# EAGLE design Nowboard (EAGLE 9.3.0)
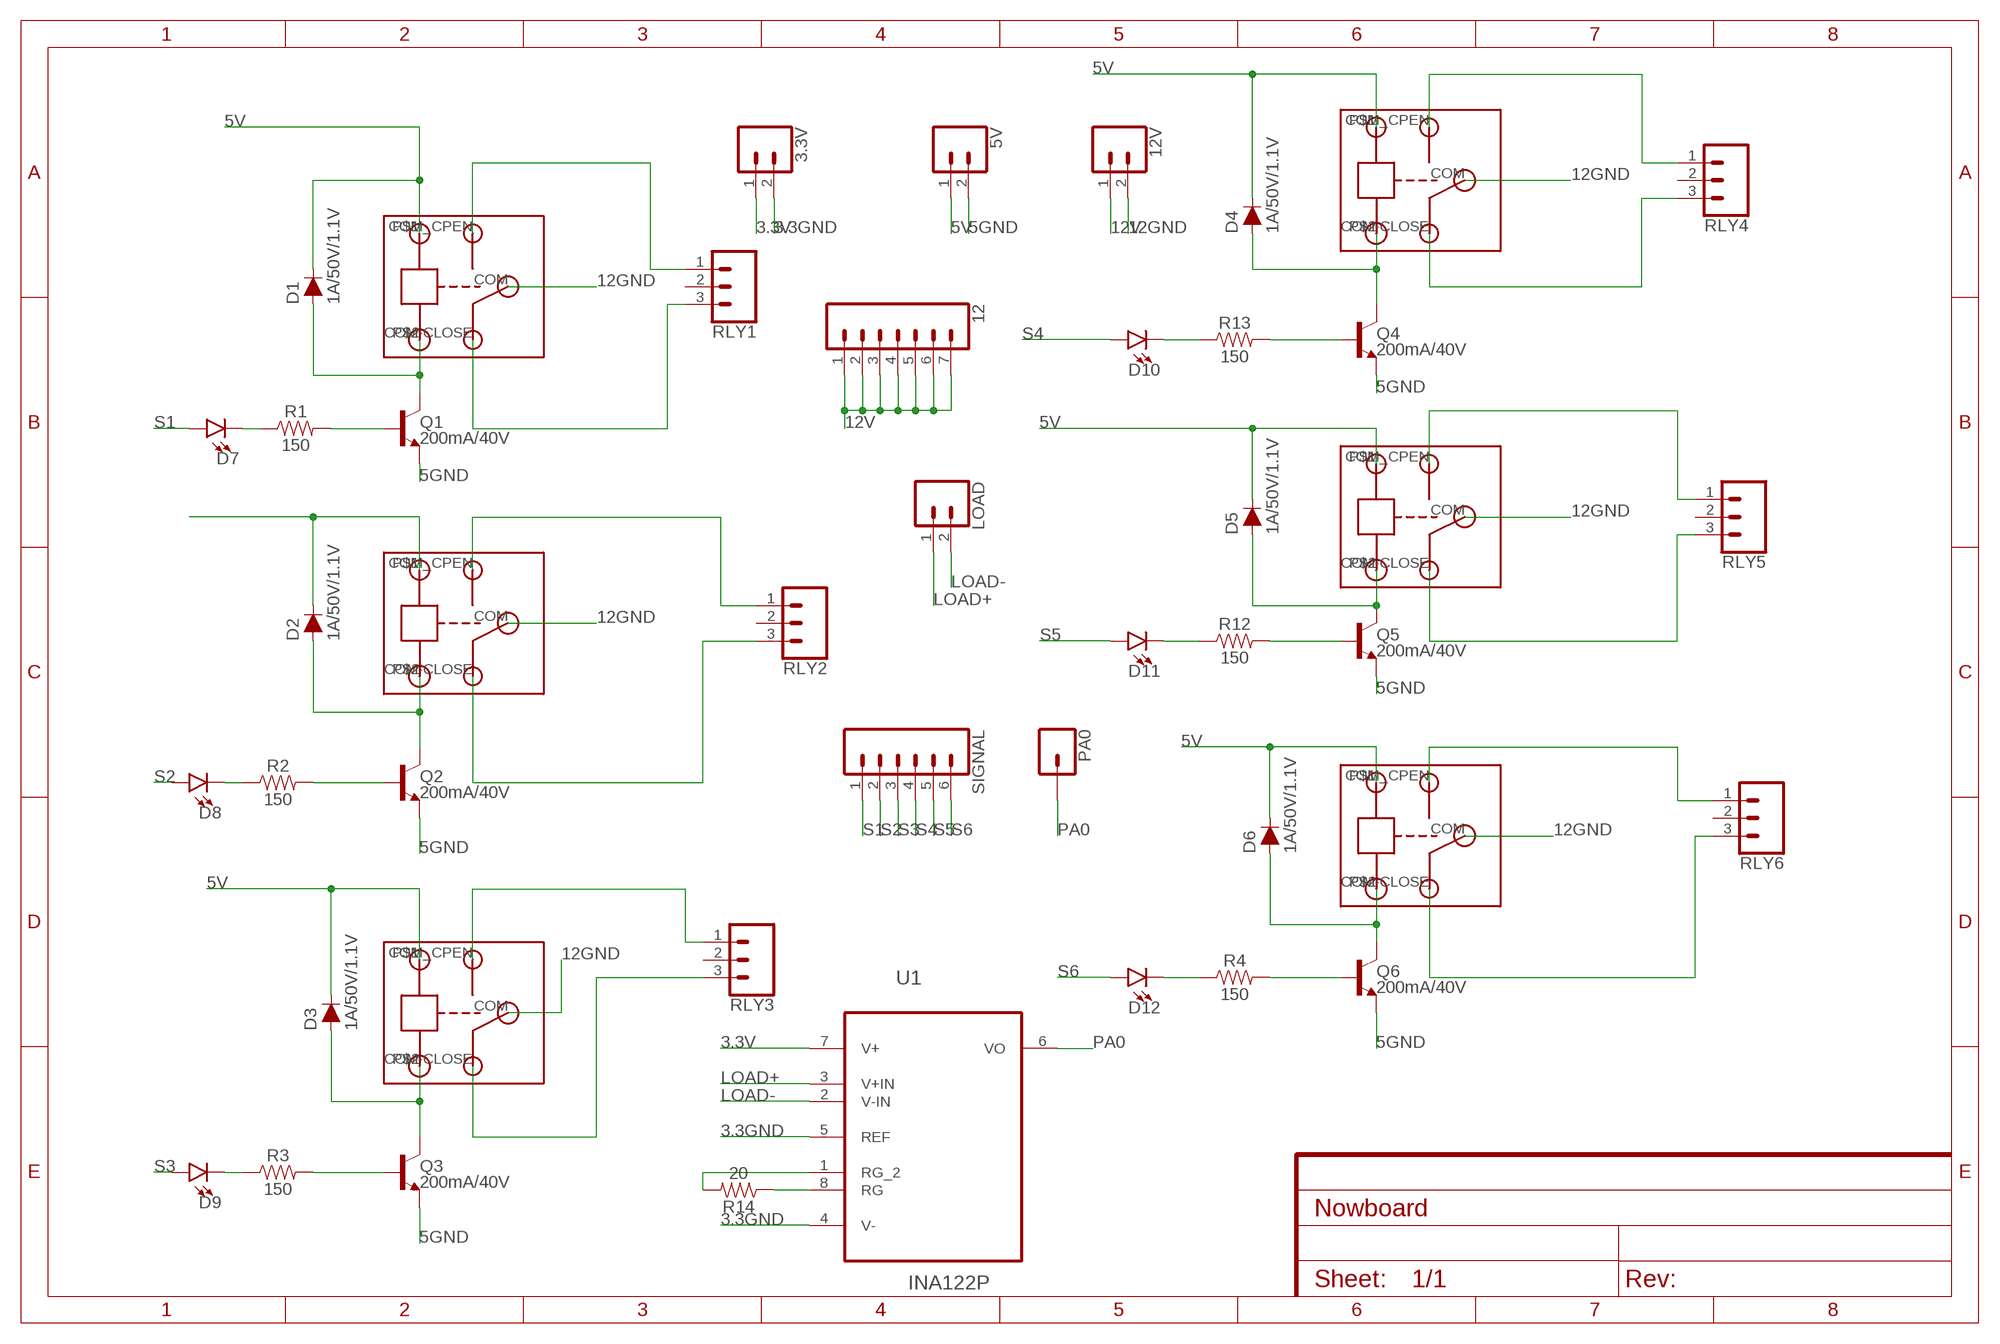
[diagram p0: schematic, sheet 1]

## Parts
3.3V  CONN_02  [1X02]
5V  CONN_02  [1X02]
12  CONN_07  [1X07]
12V  CONN_02  [1X02]
D1  1A/50V/1.1V  DIODE-PTH  [DIODE-1N4001]
D2  1A/50V/1.1V  DIODE-PTH  [DIODE-1N4001]
D3  1A/50V/1.1V  DIODE-PTH  [DIODE-1N4001]
D4  1A/50V/1.1V  DIODE-PTH  [DIODE-1N4001]
D5  1A/50V/1.1V  DIODE-PTH  [DIODE-1N4001]
D6  1A/50V/1.1V  DIODE-PTH  [DIODE-1N4001]
D7  LED3MM  [LED_3MM]
D8  LED3MM  [LED_3MM]
D9  LED3MM  [LED_3MM]
D10  LED3MM  [LED_3MM]
D11  LED3MM  [LED_3MM]
D12  LED3MM  [LED_3MM]
LOAD  CONN_02  [1X02]
PA0  CONN_01  [1X01]
Q1  200mA/40V  TRANS_NPN-2N3904  [TO-92]
Q2  200mA/40V  TRANS_NPN-2N3904  [TO-92]
Q3  200mA/40V  TRANS_NPN-2N3904  [TO-92]
Q4  200mA/40V  TRANS_NPN-2N3904  [TO-92]
Q5  200mA/40V  TRANS_NPN-2N3904  [TO-92]
Q6  200mA/40V  TRANS_NPN-2N3904  [TO-92]
R1  150  150OHM-0603-1/10W-1%  [0603]
R2  150  150OHM-0603-1/10W-1%  [0603]
R3  150  150OHM-0603-1/10W-1%  [0603]
R4  150  150OHM-0603-1/10W-1%  [0603]
R12  150  150OHM-0603-1/10W-1%  [0603]
R13  150  150OHM-0603-1/10W-1%  [0603]
R14  20  22OHM-0603-1/10W-1%  [0603]
RELAY1  RELAY  [RELAY]
RELAY2  RELAY  [RELAY]
RELAY3  RELAY  [RELAY]
RELAY4  RELAY  [RELAY]
RELAY5  RELAY  [RELAY]
RELAY6  RELAY  [RELAY]
RLY1  CONN_03  [1X03]
RLY2  CONN_03  [1X03]
RLY3  CONN_03  [1X03]
RLY4  CONN_03  [1X03]
RLY5  CONN_03  [1X03]
RLY6  CONN_03  [1X03]
SIGNAL  CONN_06NO_SILK_FEMALE_PTH  [1X06_NO_SILK]
U1  INA122P  [DIP254P762X508-8]

## Nets
3.3GND: 3.3V.2 U1.4(V-) U1.5(REF)
3.3V: 3.3V.1 U1.7(V+)
5GND: 5V.2 Q1.1(E) Q2.1(E) Q3.1(E) Q4.1(E) Q5.1(E) Q6.1(E)
5V: 5V.1 D1.C D3.C D4.C D5.C D6.C RELAY1.P$1(IN) RELAY3.P$1(IN) RELAY4.P$1(IN) RELAY5.P$1(IN) RELAY6.P$1(IN)
12GND: 12V.2 RELAY1.COM RELAY2.COM RELAY3.COM RELAY4.COM RELAY5.COM RELAY6.COM
12V: 12.1 12.2 12.3 12.4 12.5 12.6 12.7 12V.1
LOAD+: LOAD.1 U1.3(V+IN)
LOAD-: LOAD.2 U1.2(V-IN)
N$1: D1.A Q1.3(C) RELAY1.P$2(GND)
N$2: R14.1 U1.8(RG)
N$4: RELAY3.COM-CLOSE RLY3.3
N$6: RELAY4.COM_CPEN(COM-OPEN) RLY4.1
N$7: D2.A Q2.3(C) RELAY2.P$2(GND)
N$8: D3.A Q3.3(C) RELAY3.P$2(GND)
N$9: D6.A Q6.3(C) RELAY6.P$2(GND)
N$11: D5.A Q5.3(C) RELAY5.P$2(GND)
N$12: D4.A Q4.3(C) RELAY4.P$2(GND)
N$14: Q4.2(B) R13.2
N$18: Q5.2(B) R12.2
N$20: Q6.2(B) R4.2
N$21: D12.K(C) R4.1
N$22: D11.K(C) R12.1
N$24: D10.K(C) R13.1
N$25: Q3.2(B) R3.2
N$26: D9.K(C) R3.1
N$27: D8.K(C) R2.1
N$28: Q2.2(B) R2.2
N$29: D7.K(C) R1.1
N$30: Q1.2(B) R1.2
N$31: RELAY1.COM-CLOSE RLY1.3
N$33: RELAY1.COM_CPEN(COM-OPEN) RLY1.1
N$34: RELAY2.COM-CLOSE RLY2.3
N$36: D2.C RELAY2.P$1(IN)
N$37: RELAY4.COM-CLOSE RLY4.3
N$39: RELAY3.COM_CPEN(COM-OPEN) RLY3.1
N$43: RELAY2.COM_CPEN(COM-OPEN) RLY2.1
N$46: RELAY6.COM-CLOSE RLY6.3
N$48: RELAY6.COM_CPEN(COM-OPEN) RLY6.1
N$49: RELAY5.COM-CLOSE RLY5.3
N$51: RELAY5.COM_CPEN(COM-OPEN) RLY5.1
N$57: R14.2 U1.1(RG_2)
PA0 [sig]: PA0.1 U1.6(VO)
S1: D7.A SIGNAL.1
S2: D8.A SIGNAL.2
S3: D9.A SIGNAL.3
S4: D10.A SIGNAL.4
S5: D11.A SIGNAL.5
S6: D12.A SIGNAL.6
Unconnected: RLY1.2 RLY2.2 RLY3.2 RLY4.2 RLY5.2 RLY6.2

## Library data of the parts
3.3V 5V 12V LOAD = SparkFun-Connectors:CONN_02: Multi connection point. Often used as Generic Header-pin footprint for 0.1 inch spaced/style header connections On any of the 0.1 inch spaced packages, you can populate with these: Break Away Headers - Straight <https://www.sparkfun.com/products/116> (PRT-00116) Break Away Male Headers - Right Angle <https://www.sparkfun.com/products/553> (PRT-00553) Female Headers <https://www.sparkfun.com/products/115> (PRT-00115) Break Away Headers - Machine Pin <https://www.sparkfun.com/products/117> (PRT-00117) Break Away Female Headers - Swiss Machine Pin <https://www.sparkfun.com/products/743> (PRT-00743) For SCREWTERMINALS and SPRING TERMINALS visit here: Screw Terimnals on SparkFun.com <https://www.sparkfun.com/search/results?term=Screw+Terminals> (5mm/3.5mm/2.54mm spacing) This device is also useful as a general connection point to wire up your design to another part of your project. Our various solder wires solder well into these plated through hole pads. Hook-Up Wire - Assortment (Stranded, 22 AWG) <https://www.sparkfun.com/products/11375> (PRT-11375) Hook-Up Wire - Assortment (Solid Core, 22 AWG) <https://www.sparkfun.com/products/11367> (PRT-11367) View the entire wire category on our website here <https://www.sparkfun.com/categories/141> Special notes: Molex polarized connector foot print use with: PRT-08233 with associated crimp pins and housings. 2.54_SCREWTERM for use with PRT-10571. 3.5mm Screw Terminal footprints for PRT-08084 5mm Screw Terminal footprints for use with PRT-08432
12 = SparkFun-Connectors:CONN_07: Multi connection point. Often used as Generic Header-pin footprint for 0.1 inch spaced/style header connections On any of the 0.1 inch spaced packages, you can populate with these: Break Away Headers - Straight <https://www.sparkfun.com/products/116> (PRT-00116) Break Away Male Headers - Right Angle <https://www.sparkfun.com/products/553> (PRT-00553) Female Headers <https://www.sparkfun.com/products/115> (PRT-00115) Break Away Headers - Machine Pin <https://www.sparkfun.com/products/117> (PRT-00117) Break Away Female Headers - Swiss Machine Pin <https://www.sparkfun.com/products/743> (PRT-00743) For SCREWTERMINALS and SPRING TERMINALS visit here: Screw Terimnals on SparkFun.com <https://www.sparkfun.com/search/results?term=Screw+Terminals> (5mm/3.5mm/2.54mm spacing) This device is also useful as a general connection point to wire up your design to another part of your project. Our various solder wires solder well into these plated through hole pads. Hook-Up Wire - Assortment (Stranded, 22 AWG) <https://www.sparkfun.com/products/11375> (PRT-11375) Hook-Up Wire - Assortment (Solid Core, 22 AWG) <https://www.sparkfun.com/products/11367> (PRT-11367) View the entire wire category on our website here <https://www.sparkfun.com/categories/141> Special notes: Molex polarized connector foot print use with SKU : PRT-08231 with associated crimp pins and housings. 1MM SMD Version SKU: PRT-10208 NOTES ON THE VARIANTS LOCK and LOCK_LONGPADS... This footprint was designed to help hold the alignment of a through-hole component (i.e. 6-pin header) while soldering it into place. You may notice that each hole has been shifted either up or down by 0.005 of an inch from it's more standard position (which is a perfectly straight line). This slight alteration caused the pins (the squares in the middle) to touch the edges of the holes. Because they are alternating, it causes a "brace" to hold the component in place. 0.005 has proven to be the perfect amount of "off-center" position when using our standard breakaway headers. Although looks a little odd when you look at the bare footprint, once you have a header in there, the alteration is very hard to notice. Also,if you push a header all the way into place, it is covered up entirely on the bottom side.
D1-D6 = SparkFun-DiscreteSemi:DIODE: Diode These are standard reverse protection diodes and small signal diodes. SparkFun Products: SparkFun SparkPunk Sound Kit <https://www.sparkfun.com/products/11177> SparkFun ESP8266 Thing <https://www.sparkfun.com/products/13231>; PROD_ID: DIO-09176
D7-D12 = SparkFun-LED:LED: LED (Generic) Standard schematic elements and footprints for 5mm, 3mm, 1206, and 0603 sized LEDs. Generic LEDs with no color specified.; PROD_ID: DIO-08794
PA0 = SparkFun-Connectors:CONN_01: Single connection point. Often used as Generic Header-pin footprint for 0.1 inch spaced/style header connections On any of the 0.1 inch spaced packages, you can populate with these: Break Away Headers - Straight <https://www.sparkfun.com/products/116> (PRT-00116) Break Away Male Headers - Right Angle <https://www.sparkfun.com/products/553> (PRT-00553) Female Headers <https://www.sparkfun.com/products/115> (PRT-00115) Break Away Headers - Machine Pin <https://www.sparkfun.com/products/117> (PRT-00117) Break Away Female Headers - Swiss Machine Pin <https://www.sparkfun.com/products/743> (PRT-00743) This device is also useful as a general connection point to wire up your design to another part of your project. Our various solder wires solder well into these plated through hole pads. Hook-Up Wire - Assortment (Stranded, 22 AWG) <https://www.sparkfun.com/products/11375> (PRT-11375) Hook-Up Wire - Assortment (Solid Core, 22 AWG) <https://www.sparkfun.com/products/11367> (PRT-11367) View the entire wire category on our website here <https://www.sparkfun.com/categories/141> Special notes: SMTSO-256-ET is a "flush mount" nut for a 4-40 screw. We mostly use this on specialty testbeds; it is a nice way to connect hardware to your PCB at an adjustable hieght. Also note, the SNAP packages are for using a snappable style connector. We sell a baggie of snaps and they are also used on two LilyPad designs: Snap Assortment - 30 pack (male and female) <https://www.sparkfun.com/products/11347> (DEV-11347) LilyPad Arduino SimpleSnap <https://www.sparkfun.com/products/10941> (DEV-10941) LilyPad SimpleSnap Protoboard <https://www.sparkfun.com/products/10940> (DEV-10940)
Q1-Q6 = SparkFun-DiscreteSemi:TRANS_NPN: NPN transistor Current controlled devices typically used to amplify current or used as a switch. BC547 - COM-08928 <http://www.sparkfun.com/products/8928> (TO-92 45V 100mA) (1.Collector 2.Base 3.Emitter) 2N3904 - COM-00521 <http://www.sparkfun.com/products/521> (TO-92 40V 200mA) (1.Emitter 2.Base 3.Collector) P2N2222A - COM-12852 <http://www.sparkfun.com/products/12852> (TO-92 40V 600mA) (1.Collector 2.Base 3.Emitter); PROD_ID: TRANS-08447
R1-R4 R12 R13 = SparkFun-Resistors:150OHM: 150Ω resistor A resistor is a passive two-terminal electrical component that implements electrical resistance as a circuit element. Resistors act to reduce current flow, and, at the same time, act to lower voltage levels within circuits. - Wikipedia; PROD_ID: RES-11028
R14 = SparkFun-Resistors:22OHM: 22Ω resistor A resistor is a passive two-terminal electrical component that implements electrical resistance as a circuit element. Resistors act to reduce current flow, and, at the same time, act to lower voltage levels within circuits. - Wikipedia; PROD_ID: RES-08698; VALUE: 22
RELAY1-RELAY6 = RELAY:RELAY
RLY1-RLY6 = SparkFun-Connectors:CONN_03: Multi connection point. Often used as Generic Header-pin footprint for 0.1 inch spaced/style header connections On any of the 0.1 inch spaced packages, you can populate with these: Break Away Headers - Straight <https://www.sparkfun.com/products/116> (PRT-00116) Break Away Male Headers - Right Angle <https://www.sparkfun.com/products/553> (PRT-00553) Female Headers <https://www.sparkfun.com/products/115> (PRT-00115) Break Away Headers - Machine Pin <https://www.sparkfun.com/products/117> (PRT-00117) Break Away Female Headers - Swiss Machine Pin <https://www.sparkfun.com/products/743> (PRT-00743) Stackable Header - 3 Pin (Female, 0.1") <https://www.sparkfun.com/products/13875> (PRT-13875) For SCREWTERMINALS and SPRING TERMINALS visit here: Screw Terimnals on SparkFun.com <https://www.sparkfun.com/search/results?term=Screw+Terminals> (5mm/3.5mm/2.54mm spacing) This device is also useful as a general connection point to wire up your design to another part of your project. Our various solder wires solder well into these plated through hole pads. Hook-Up Wire - Assortment (Stranded, 22 AWG) <https://www.sparkfun.com/products/11375> (PRT-11375) Hook-Up Wire - Assortment (Solid Core, 22 AWG) <https://www.sparkfun.com/products/11367> (PRT-11367) View the entire wire category on our website here <https://www.sparkfun.com/categories/141> Special notes: Molex polarized connector foot print use with SKU : PRT-08232 with associated crimp pins and housings.
SIGNAL = SparkFun-Connectors:CONN_06: Multi connection point. Often used as Generic Header-pin footprint for 0.1 inch spaced/style header connections On any of the 0.1 inch spaced packages, you can populate with these: Break Away Headers - Straight <https://www.sparkfun.com/products/116> (PRT-00116) Break Away Male Headers - Right Angle <https://www.sparkfun.com/products/553> (PRT-00553) Female Headers <https://www.sparkfun.com/products/115> (PRT-00115) Break Away Headers - Machine Pin <https://www.sparkfun.com/products/117> (PRT-00117) Break Away Female Headers - Swiss Machine Pin <https://www.sparkfun.com/products/743> (PRT-00743) Arduino Stackable Header - 6 Pin <https://www.sparkfun.com/products/9280> (PRT-09280) For SCREWTERMINALS and SPRING TERMINALS visit here: Screw Terimnals on SparkFun.com <https://www.sparkfun.com/search/results?term=Screw+Terminals> (5mm/3.5mm/2.54mm spacing) This device is also useful as a general connection point to wire up your design to another part of your project. Our various solder wires solder well into these plated through hole pads. Hook-Up Wire - Assortment (Stranded, 22 AWG) <https://www.sparkfun.com/products/11375> (PRT-11375) Hook-Up Wire - Assortment (Solid Core, 22 AWG) <https://www.sparkfun.com/products/11367> (PRT-11367) View the entire wire category on our website here <https://www.sparkfun.com/categories/141>; PROD_ID: CONN-08437
U1 = INA122P:INA122P: INSTRUMENTATION AMPLIFIER; AVAILABILITY: Unavailable; MF: Texas Instruments; MP: INA122P; PACKAGE: PDIP-8 Burr Brown; PRICE: None

## Net classes
0 default: width 0.914 mm, clearance 0.457 mm
1 sig: width 0.152 mm, drill 0.152 mm, clearance 0.076 mm

## Board
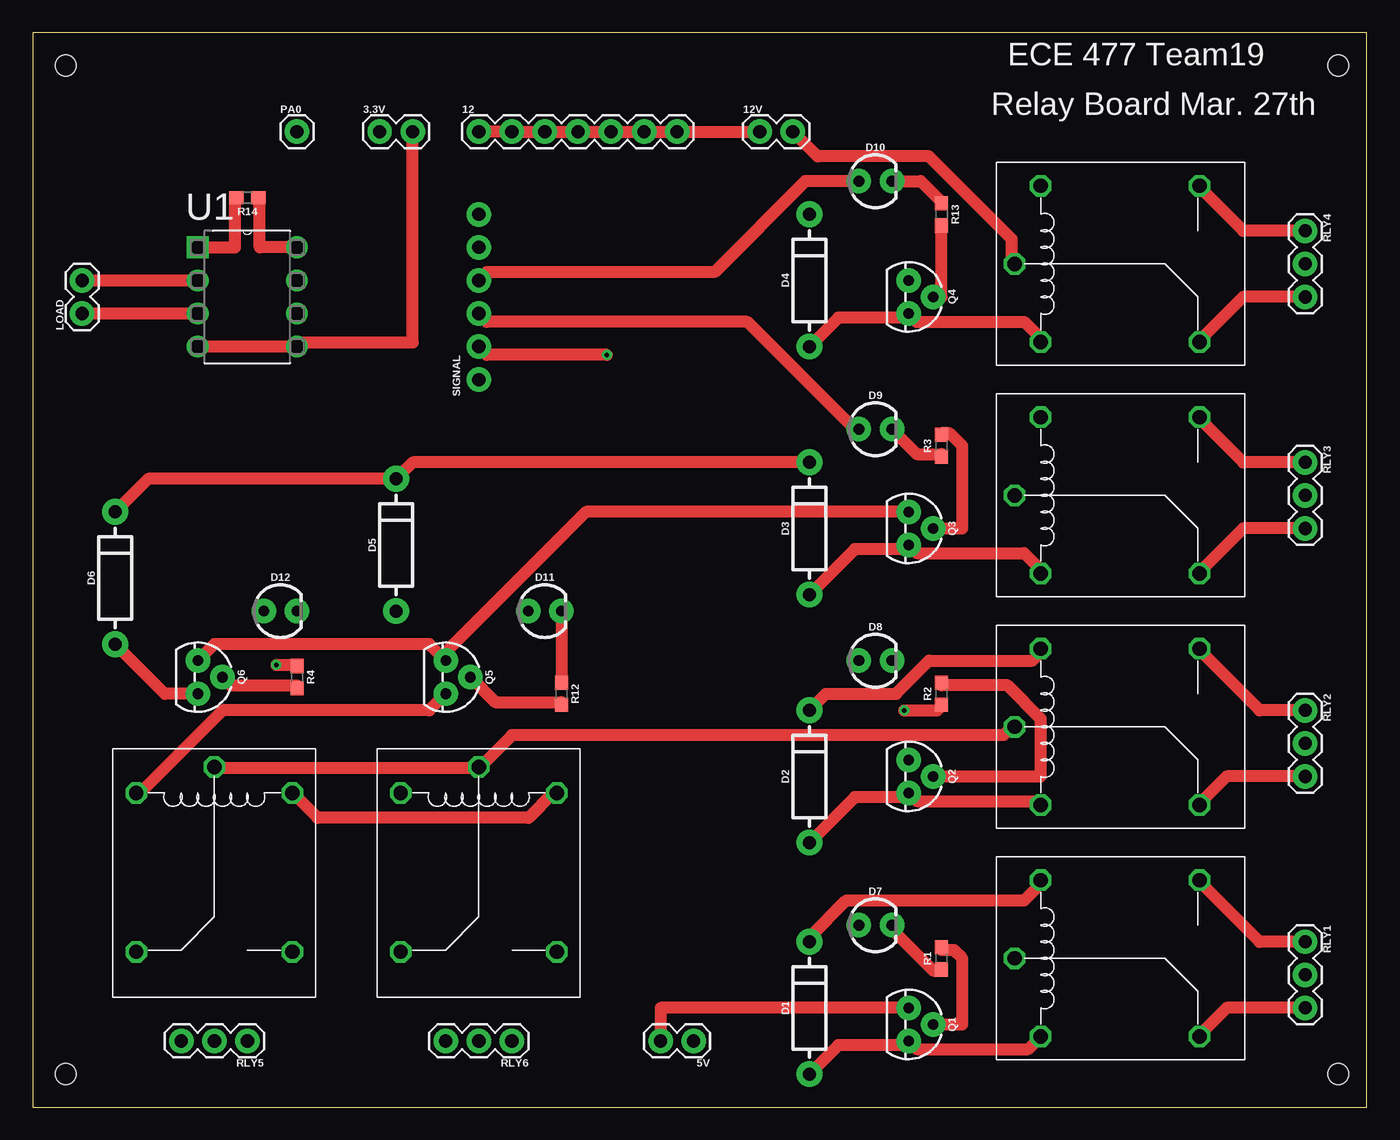
[diagram p1: board, top side]
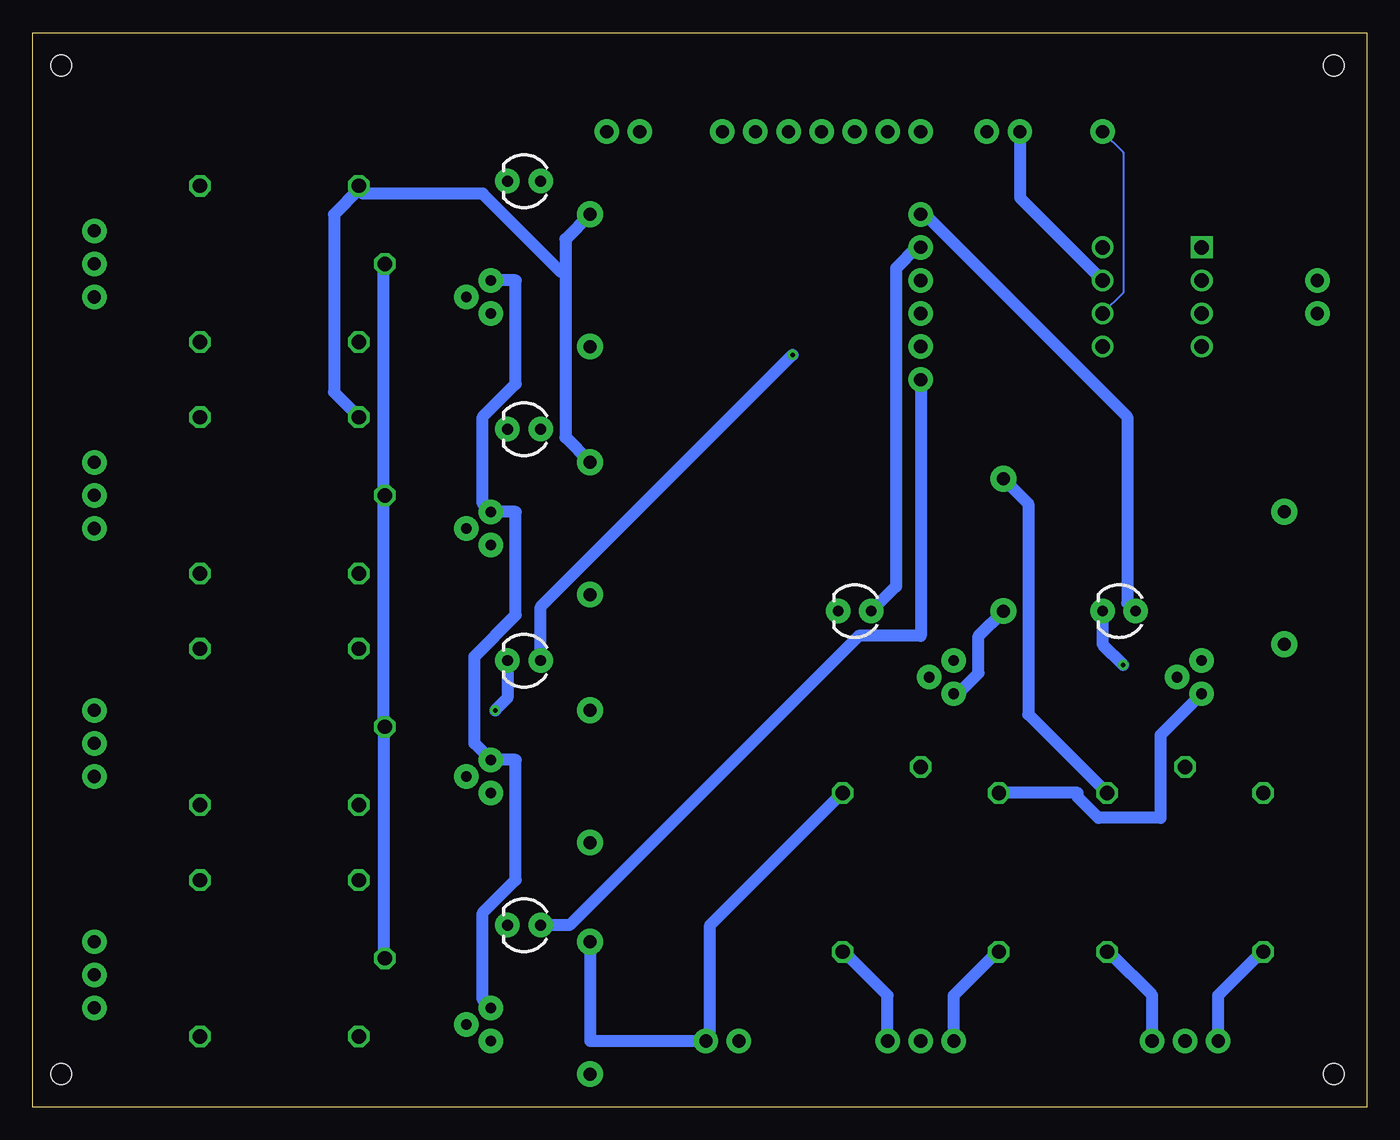
[diagram p2: board, bottom side, seen from below]

Size 102.54 x 82.54 mm. Coordinates in mm from the lower left corner, seen from the top.
Outline: 0,0 102.54,0 102.54,82.54 0,82.54 0,0
Copper layers (1*16): Top 0.035mm / dielectric 1.5mm / Bottom 0.035mm
Design rules "default": minimum track width 6mil, minimum drill 0.35mm, track to track 6mil, track to pad 6mil, pad to pad 6mil, via to via 6mil, smd to smd 6mil, copper to edge 40mil, drill to drill 6mil, minimum pad ring 10mil, minimum via ring 8mil, stop-mask expansion 4mil, vias tented up to drill 0mil, thermal gap 10mil
Holes 1.6 mm at 2.54,80.01 2.54,2.54 100.33,2.54 100.33,80.01

### Footprints (pad centres in the part's own frame; a part is rotated, then mirrored left to right if it is on the bottom)
1X02 = drill 1.016 pad 1.88: 1 0,0; 2 2.54,0
1X07 = drill 1.016 pad 1.88: 1 0,0; 2 2.54,0; 3 5.08,0; 4 7.62,0; 5 10.16,0; 6 12.7,0; 7 15.24,0
DIODE-1N4001 = drill 1 pad 1.981: A -5.08,0; C 5.08,0
LED_3MM = drill 0.813 pad 1.88: A -1.27,0; K 1.27,0
1X01 = drill 1.016 pad 1.88: 1 0,0
TO-92 = drill 0.813 pad 1.88: 1 -1.27,0; 2 0,1.905; 3 1.27,0
0603 = smd 1.1 x 1: 1 -0.85,0; 2 0.85,0
RELAY = drill 1.1 octagon: COM -2,0; COM-CLOSE 12.2,-6; COM_CPEN 12.2,6; P$1 0,6; P$2 0,-6
1X03 = drill 1.016 pad 1.88: 1 0,0; 2 2.54,0; 3 5.08,0
1X06_NO_SILK = drill 1.016 pad 1.88: 1 0,0; 2 2.54,0; 3 5.08,0; 4 7.62,0; 5 10.16,0; 6 12.7,0
DIP254P762X508-8 = drill 1.118 square: 1 -7.62,7.62 | drill 1.118: 2 -7.62,5.08; 3 -7.62,2.54; 4 -7.62,0; 5 0,0; 6 0,2.54; 7 0,5.08; 8 0,7.62

### Placement (x,y rotation side)
3.3V  26.67,74.93 0 top
5V  50.8,5.08 180 top
12  34.29,74.93 0 top
12V  55.88,74.93 0 top
D1  59.69,7.62 90 top
D2  59.69,25.4 90 top
D3  59.69,44.45 90 top
D4  59.69,63.5 90 top
D5  27.94,43.18 90 top
D6  6.35,40.64 90 top
D7  64.77,13.97 0 top
D8  64.77,34.29 0 top
D9  64.77,52.07 0 top
D10  64.77,71.12 0 top
D11  39.37,38.1 0 top
D12  19.05,38.1 0 top
LOAD  3.81,60.96 90 top
PA0  20.32,74.93 0 top
Q1  67.31,6.35 270 top
Q2  67.31,25.4 270 top
Q3  67.31,44.45 270 top
Q4  67.31,62.23 270 top
Q5  31.75,33.02 270 top
Q6  12.7,33.02 270 top
R1  69.85,11.43 90 top
R2  69.85,31.75 90 top
R3  69.85,50.8 90 top
R4  20.32,33.02 270 top
R12  40.64,31.75 270 top
R13  69.85,68.58 270 top
R14  16.51,69.85 180 top
RELAY1  77.47,11.43 0 top
RELAY2  77.47,29.21 0 top
RELAY3  77.47,46.99 0 top
RELAY4  77.47,64.77 0 top
RELAY5  13.97,24.13 270 top
RELAY6  34.29,24.13 270 top
RLY1  97.79,12.7 270 top
RLY2  97.79,30.48 270 top
RLY3  97.79,49.53 270 top
RLY4  97.79,67.31 270 top
RLY5  16.51,5.08 180 top
RLY6  36.83,5.08 180 top
SIGNAL  34.29,55.88 90 top
U1  20.32,58.42 0 top

### Tracks (layer width: path | path; a pad name or v marks a point on that pad's centre or on a via)
3.3GND
  Top 0.914: U1.4 U1.5 20.64,58.74 29.21,58.74 3.3V.2
3.3V
  Bottom 0.914: U1.7 26.67,69.85 3.3V.1
5GND
  Top 0.914: Q6.1 13.97,35.56 30.48,35.56 Q5.1 31.75,34.93 42.55,45.72 Q3.1 | 5V.2 48.26,7.62 Q1.1
  Bottom 0.914: Q1.1 67.95,8.26 67.95,14.92 65.41,17.46 65.41,26.67 Q2.1 68.58,27.94 68.58,34.61 65.41,37.78 65.41,45.72 Q3.1 67.95,46.36 67.95,53.02 65.41,55.56 65.41,63.5 Q4.1
5V
  Top 0.914: RELAY5.P$1 20,24.13 21.91,22.22 38.1,22.22 40.01,24.13 RELAY6.P$1 | D1.C 59.69,13.02 62.55,15.88 76.2,15.88 77.47,17.14 RELAY1.P$1 | D6.C 8.89,48.26 D5.C 29.21,49.53 D3.C
  Bottom 0.914: D1.C 59.69,5.08 5V.1 50.48,5.4 50.48,13.97 40.32,24.13 RELAY6.P$1 | RELAY3.P$1 77.47,53.02 79.38,54.93 79.38,68.58 77.47,70.48 RELAY4.P$1 77.15,70.17 67.95,70.17 61.91,64.14 61.59,64.14 | D3.C 61.59,51.44 61.59,64.14 | 61.59,64.14 61.59,66.67 D4.C | D5.C 26.04,46.36 26.04,30.16 20,24.13 RELAY5.P$1
12GND
  Top 0.914: RELAY5.COM 13.97,26.04 34.29,26.04 RELAY6.COM 34.61,26.35 36.83,28.57 74.61,28.57 75.25,29.21 RELAY2.COM | 12V.2 60.32,73.02 68.9,73.02 75.25,66.67 75.25,64.77 RELAY4.COM
  Bottom 0.914: RELAY1.COM 75.57,11.43 75.57,29.21 RELAY2.COM 75.57,29.53 75.57,46.99 RELAY3.COM 75.57,47.31 75.57,64.77 RELAY4.COM
12V
  Top 0.914: 12.1 12.2 12.3 12.4 12.5 12.6 12.7 12V.1
LOAD+
  Top 0.914: LOAD.1 U1.3
LOAD-
  Top 0.914: LOAD.2 U1.2
N$1
  Top 0.914: RELAY1.P$2 77.47,5.4 76.52,4.45 67.95,4.45 Q1.3 66.99,4.76 61.91,4.76 D1.A
N$2
  Top 0.914: U1.8 17.46,66.04 17.46,69.85 R14.1
N$4
  Top 0.914: RLY3.3 93.03,44.45 89.85,41.28 RELAY3.COM-CLOSE
N$6
  Top 0.914: RLY4.1 93.03,67.31 89.85,70.48 RELAY4.COM_CPEN
N$7
  Top 0.914: RELAY2.P$2 77.47,23.5 67.95,23.5 Q2.3 66.99,23.81 63.18,23.81 D2.A
N$8
  Top 0.914: RELAY3.P$2 77.47,41.28 76.2,42.55 67.95,42.55 Q3.3 66.99,42.86 63.18,42.86 D3.A
N$9
  Top 0.914: D6.A 10.16,31.75 Q6.3
  Bottom 0.914: RELAY6.P$2 22.22,24.13 22.22,23.81 20.64,22.22 15.88,22.22 15.88,28.57 Q6.3
N$11
  Top 0.914: Q5.3 30.48,30.48 14.61,30.48 8.25,24.13 RELAY5.P$2
  Bottom 0.914: D5.A 29.84,36.2 29.84,33.34 31.43,31.75 Q5.3
N$12
  Top 0.914: RELAY4.P$2 77.47,59.05 76.2,60.33 67.95,60.33 Q4.3 66.99,60.64 61.91,60.64 D4.A
N$14
  Top 0.914: R13.2 69.85,62.23 Q4.2
N$18
  Top 0.914: Q5.2 35.56,31.11 40.64,31.11 R12.2
N$20
  Top 0.914: Q6.2 15.24,32.38 20.32,32.38 R4.2
N$21  (via drill 0.35)
  Top 0.914: v18.73,33.97 20.32,33.97 R4.1
  Bottom 0.914: v18.73,33.97 20.32,35.56 D12.K
N$22
  Top 0.914: D11.K R12.1
N$24
  Top 0.914: D10.K 68.26,71.12 69.85,69.53 R13.1
N$25
  Top 0.914: Q3.2 71.44,44.45 71.44,50.8 70.48,51.75 69.85,51.75 R3.2
N$26
  Top 0.914: D9.K 67.95,50.17 69.85,50.17 R3.1
N$27  (via drill 0.35)
  Top 0.914: v66.99,30.48 69.53,30.48 69.85,30.8 R2.1
  Bottom 0.914: v66.99,30.48 66.04,31.43 D8.K
N$28
  Top 0.914: Q2.2 77.47,25.4 77.47,29.84 74.93,32.38 69.85,32.38 R2.2
N$29
  Top 0.914: D7.K 66.04,13.65 69.22,10.48 69.85,10.48 R1.1
N$30
  Top 0.914: Q1.2 71.44,6.35 71.44,11.43 70.8,12.06 69.85,12.06 R1.2
N$31
  Top 0.914: RLY1.3 91.76,7.62 89.85,5.71 RELAY1.COM-CLOSE
N$33
  Top 0.914: RLY1.1 94.3,12.7 89.85,17.14 RELAY1.COM_CPEN
N$34
  Top 0.914: RLY2.3 91.76,25.4 89.85,23.5 RELAY2.COM-CLOSE
N$36
  Top 0.914: D2.C 60.96,31.75 66.36,31.75 68.9,34.29 76.84,34.29 77.47,34.93 RELAY2.P$1
N$37
  Top 0.914: RLY4.3 93.03,62.23 89.85,59.05 RELAY4.COM-CLOSE
N$39
  Top 0.914: RLY3.1 93.03,49.53 89.85,52.71 RELAY3.COM_CPEN
N$43
  Top 0.914: RLY2.1 94.3,30.48 89.85,34.93 RELAY2.COM_CPEN
N$46
  Bottom 0.914: RLY6.3 31.75,8.57 28.57,11.75 RELAY6.COM-CLOSE
N$48
  Bottom 0.914: RLY6.1 36.83,8.57 40.01,11.75 RELAY6.COM_CPEN
N$49
  Bottom 0.914: RLY5.3 11.43,8.57 8.25,11.75 RELAY5.COM-CLOSE
N$51
  Bottom 0.914: RLY5.1 16.51,8.57 19.68,11.75 RELAY5.COM_CPEN
N$57
  Top 0.914: U1.1 15.56,66.04 15.56,69.85 R14.2
PA0
  Bottom 0.152: U1.6 18.73,62.55 18.73,73.34 PA0.1
S1
  Bottom 0.914: D7.A 61.28,13.97 39.05,36.2 34.29,36.2 SIGNAL.1
S2  (via drill 0.35)
  Top 0.914: SIGNAL.2 34.92,57.79 v44.13,57.79
  Bottom 0.914: v44.13,57.79 63.5,38.42 D8.A
S3
  Top 0.914: SIGNAL.3 34.92,60.33 54.93,60.33 63.18,52.07 D9.A
S4
  Top 0.914: SIGNAL.4 34.92,64.14 52.39,64.14 59.37,71.12 D10.A
S5
  Bottom 0.914: D11.A 36.2,40.01 36.2,64.45 34.61,66.04 SIGNAL.5
S6
  Bottom 0.914: D12.A 18.41,38.74 18.41,53.02 33.97,68.58 SIGNAL.6

### Text on the board
tNames: ECE 477 Team19 | Relay Board Mar. 27th